# Altium schematic sheet MCU.SchDoc: =SheetTitle
size A3; CompanyName: Catcatcat Electronics; Engineer: Hena Chernov; SheetNumber: 6; SheetTotal: 10; CodePhone: +380505759863; SheetDescription: Microcontroller connection schematic.; Email: catcatcat.electronics@gmail.com
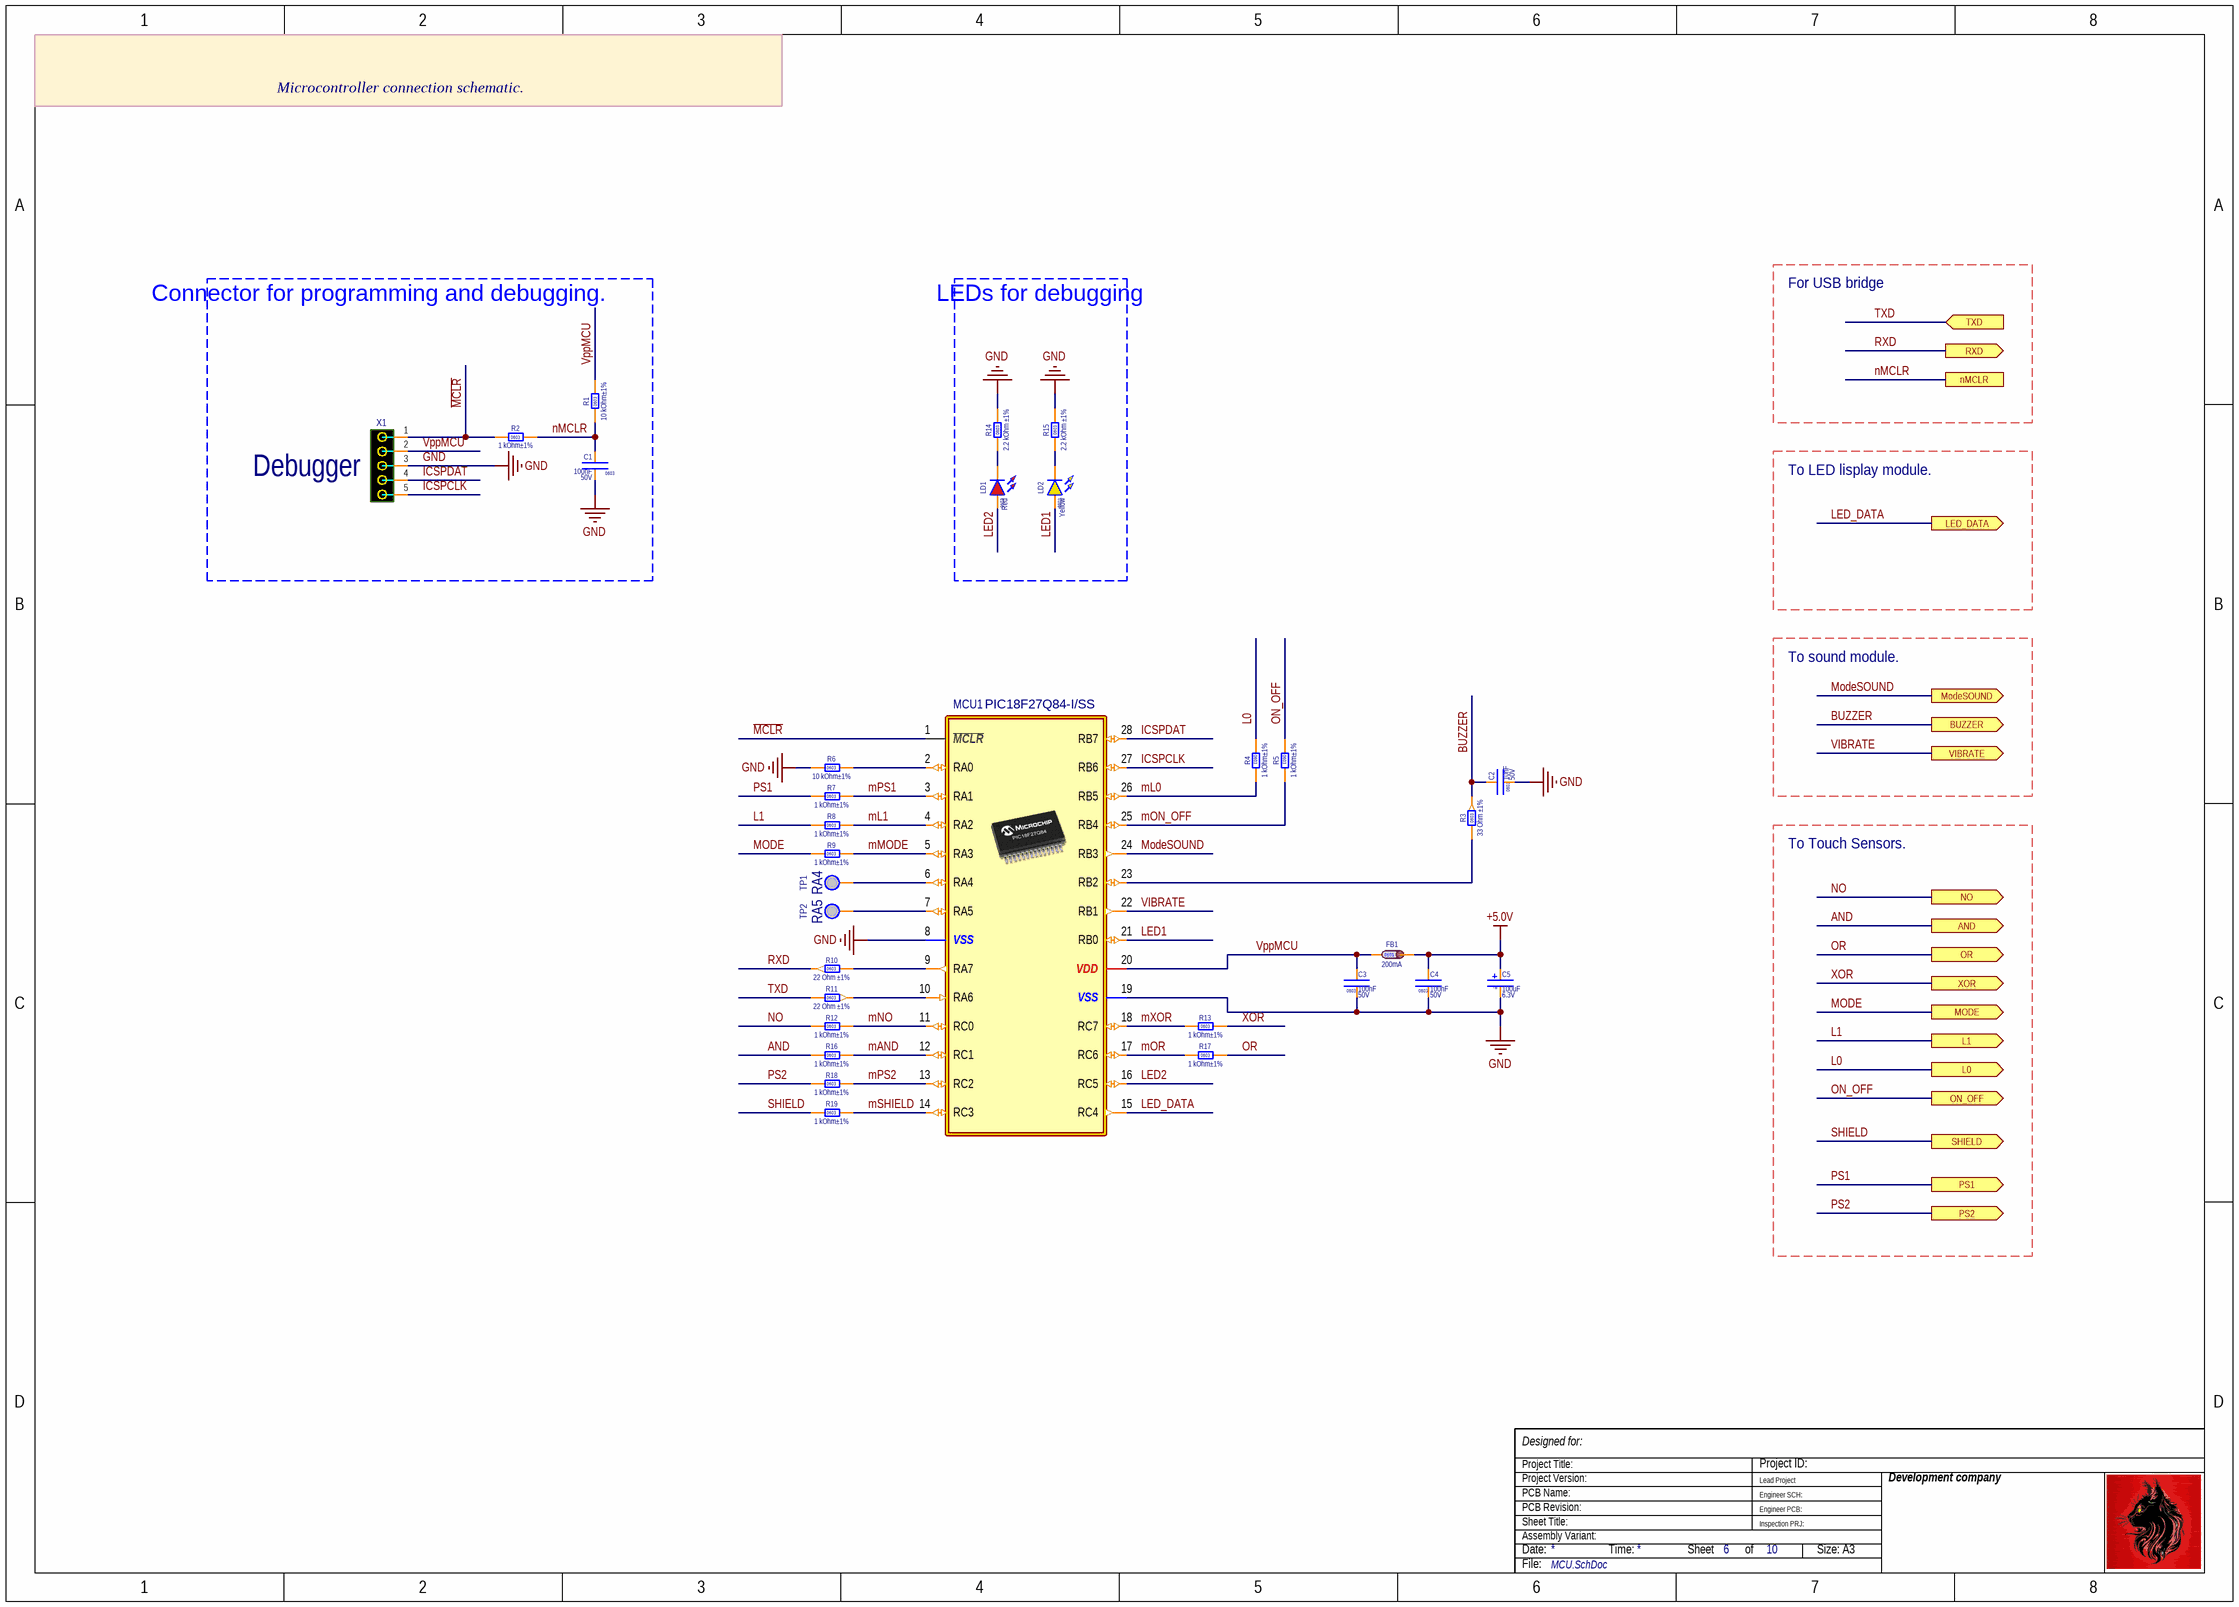
[diagram p0: MCU.SchDoc]

## Parts
C1  value 100nF  Voltage: 50V  [CC0603(1608)x0.8]  (hidden comment: 100 nF ±10% 50V)
C2  value 10nF  Voltage: 50V  [CC0603(1608)x0.8]  (hidden comment: 10 nF ±10% 50V)
C3  value 100nF  Voltage: 50V  [CC0603(1608)x0.8]  (hidden comment: 100 nF ±10% 50V)
C4  value 100nF  Voltage: 50V  [CC0603(1608)x0.8]  (hidden comment: 100 nF ±10% 50V)
C5  value 100uF  Voltage: 6.3V  [TANTAL_B]  (hidden comment: 100UF 6.3V CASE-B_3528)
FB1  value 200mA  [FB0603(1608)]  (hidden comment: GZ1608D601TF)
LD1  value Red  Case/Package: 0603  [LD0603 RED]  (hidden comment: KT-0603R)
LD2  value Yellow  Case/Package: 0603  [LD0603 YELLOW]  (hidden comment: LED 0603 Yellow 120° 60mW)
MCU1  PIC18F27Q84-I/SS  [FP-C04-073-IPC_C]
R1  value 10 kOhm±1%  [RC0603(1608) -1%]  (hidden comment: 10K ±1% 0603)
R2  value 1 kOhm±1%  [RC0603(1608) -1%]  (hidden comment: 1K ±1% 0603)
R3  value 33 Ohm ±1%  [RC0603(1608) -1%]  (hidden comment: 33R ±1% 0603)
R4  value 1 kOhm±1%  [RC0603(1608) -1%]  (hidden comment: 1K ±1% 0603)
R5  value 1 kOhm±1%  [RC0603(1608) -1%]  (hidden comment: 1K ±1% 0603)
R6  value 10 kOhm±1%  [RC0603(1608) -1%]  (hidden comment: 10K ±1% 0603)
R7  value 1 kOhm±1%  [RC0603(1608) -1%]  (hidden comment: 1K ±1% 0603)
R8  value 1 kOhm±1%  [RC0603(1608) -1%]  (hidden comment: 1K ±1% 0603)
R9  value 1 kOhm±1%  [RC0603(1608) -1%]  (hidden comment: 1K ±1% 0603)
R10  value 22 Ohm ±1%  [RC0603(1608) -1%]  (hidden comment: 22R ±1% 0603)
R11  value 22 Ohm ±1%  [RC0603(1608) -1%]  (hidden comment: 22R ±1% 0603)
R12  value 1 kOhm±1%  [RC0603(1608) -1%]  (hidden comment: 1K ±1% 0603)
R13  value 1 kOhm±1%  [RC0603(1608) -1%]  (hidden comment: 1K ±1% 0603)
R14  value 2.2 kOhm ±1%  [RC0603(1608) -1%]  (hidden comment: 2.2K ±1% 0603)
R15  value 2.2 kOhm ±1%  [RC0603(1608) -1%]  (hidden comment: 2.2K ±1% 0603)
R16  value 1 kOhm±1%  [RC0603(1608) -1%]  (hidden comment: 1K ±1% 0603)
R17  value 1 kOhm±1%  [RC0603(1608) -1%]  (hidden comment: 1K ±1% 0603)
R18  value 1 kOhm±1%  [RC0603(1608) -1%]  (hidden comment: 1K ±1% 0603)
R19  value 1 kOhm±1%  [RC0603(1608) -1%]  (hidden comment: 1K ±1% 0603)
TP1  RA4  [Test_Point_T_0.6mm]  (no BOM)
TP2  RA5  [Test_Point_T_0.6mm]  (no BOM)
X1  PL2N-05n  [PL2N-05]  (value not drawn)

## Blocks framed on the sheet
Debugger: C1 R1 R2 X1
LEDs for debugging: LD1 LD2 R14 R15

## Ports
AND (out), BUZZER (out), L0 (out), L1 (out), LED_DATA (out), MODE (out), ModeSOUND (out), nMCLR, NO (out), ON_OFF (out), OR (out), PS1 (out), PS2 (out), RXD (out), SHIELD (out), TXD (in), VIBRATE (out), XOR (out)

## Nets
+5.0V: C4.2 C5.1 FB1.1
GND: C1.1 C2.1 C3.1 C4.1 C5.2 MCU1.8(VSS) MCU1.19(VSS) R6.1 R14.1 R15.1 X1.3
~{MCLR}: MCU1.1(~{MCLR}) R2.2 X1.1
AND: R16.2 ; port AND
BUZZER: C2.2 R3.2 ; port BUZZER
ICSPCLK: MCU1.27(RB6) X1.5
ICSPDAT: MCU1.28(RB7) X1.4
L0: R4.1 ; port L0
L1: R8.1 ; port L1
LED1: LD2.2 MCU1.21(RB0)
LED2: LD1.2 MCU1.16(RC5)
LED_DATA: MCU1.15(RC4) ; port LED_DATA
mAND: MCU1.12(RC1) R16.1
mL0: MCU1.26(RB5) R4.2
mL1: MCU1.4(RA2) R8.2
mMODE: MCU1.5(RA3) R9.1
mNO: MCU1.11(RC0) R12.1
MODE: R9.2 ; port MODE
ModeSOUND: MCU1.24(RB3) ; port ModeSOUND
mON_OFF: MCU1.25(RB4) R5.2
mOR: MCU1.17(RC6) R17.1
mPS1: MCU1.3(RA1) R7.2
mPS2: MCU1.13(RC2) R18.1
mSHIELD: MCU1.14(RC3) R19.2
mXOR: MCU1.18(RC7) R13.1
nMCLR: C1.2 R1.1 R2.1 ; port nMCLR
NO: R12.2 ; port NO
ON_OFF: R5.1 ; port ON_OFF
OR: R17.2 ; port OR
PS1: R7.1 ; port PS1
PS2: R18.2 ; port PS2
RXD: R10.1 ; port RXD
SHIELD: R19.1 ; port SHIELD
TXD: R11.1 ; port TXD
VIBRATE: MCU1.22(RB1) ; port VIBRATE
VppMCU: C3.2 FB1.2 MCU1.20(VDD) R1.2 X1.2
XOR: R13.2 ; port XOR
NetLD1_1: LD1.1 R14.2
NetLD2_1: LD2.1 R15.2
NetMCU1_2: MCU1.2(RA0) R6.2
NetMCU1_6: MCU1.6(RA4) TP1.1
NetMCU1_7: MCU1.7(RA5) TP2.1
NetMCU1_9: MCU1.9(RA7) R10.2
NetMCU1_10: MCU1.10(RA6) R11.2
NetMCU1_23: MCU1.23(RB2) R3.1

## Notes on the sheet
- Connector for programming and debugging.
- For USB bridge
- To LED lisplay module.
- To sound module.
- To Touch Sensors.
- Project Title:
- Project Version:
- Designed for:
- Lead Project
- Project ID:
- Development company
- Date:
- PCB Revision:
- PCB Name:
- Sheet Title:
- Assembly Variant:
- Time:
- Sheet
- of
- Engineer SCH:
- Engineer PCB:
- Inspection PRJ:
- Size: A3
- File:
- (in symbol TANTAL-B 100uF 6.3V (B)) TB

## Library data of the parts
C1 C3 C4 = 0603 0.1 uF (B): 100 nF ±10% 50V X7R; Manufacturer 1: YAGEO; Manufacturer Part Number 1: CC0603KRX7R9BB104; Note: Ceramic Capacitors; Detailed Description: 50V 100nF X7R ±10% 0603  Multilayer Ceramic Capacitors MLCC - SMD/SMT ROHS; Case/Package: 0603; Publisher: Catcatcat Electronics; Tolerance: ±10%; HelpURL: https://datasheet.lcsc.com/lcsc/1809301912_YAGEO-CC0603KRX7R9BB104_C14663.pdf; website developer: http://catcatcat.d-lan.dp.ua/; Temperature Coefficient: X7R; Supplier URL 1: https://jlcpcb.com/parts/componentSearch?searchTxt=; Operating Temperature: -55C to +125C; Supplier Part Number 1: C14663; Supplier Unit Price 1: 0.0021; Assembly type: Basic Part; Footprint check status: Verified; QuantityElements: 1; Supplier 1: LCSC; MountType: SMD
C2 = 0603 0.01 uF (B): 10 nF ±10% 50V X7R; Manufacturer 1: Guangdong Fenghua Advanced Tech; Manufacturer Part Number 1: 0603B103K500NT; Note: Ceramic Capacitors; Detailed Description: 50V 10nF X7R ±10% 0603  Multilayer Ceramic Capacitors MLCC - SMD/SMT ROHS; Case/Package: 0603; Publisher: Catcatcat Electronics; Tolerance: ±10%; HelpURL: https://datasheet.lcsc.com/szlcsc/Guangdong-Fenghua-Advanced-Tech-0603B103K500NT_C57112.pdf; Website Developer: http://catcatcat.d-lan.dp.ua/; Temperature Coefficient: X7R; Supplier URL 1: https://jlcpcb.com/parts/componentSearch?searchTxt=; Operating Temperature: -55C to +125C; Supplier Part Number 1: C57112; Supplier Unit Price 1: 0.0012; Assembly type: Basic Part; Footprint check status: Verified; QuantityElements: 1; Supplier 1: LCSC; MountType: SMD
C5 = TANTAL-B 100uF 6.3V (B): Tantalum Capacitors 100uF 6.3V CASE-B_3528 RoHS; Manufacturer 1: AVX; Manufacturer Part Number 1: TAJB107K006RNJ; Lifetime @ Temp: 2000Hrs@105℃; Case/Package: CASE-B_3528; Publisher: Catcatcat Electronics; Note: Tantalum Capacitors; HelpURL: https://datasheet.lcsc.com/szlcsc/AVX-TAJB107K006RNJ_C16133.pdf; website developer: http://catcatcat.d-lan.dp.ua/; Detailed Description: Tantalum Capacitors 100uF 6.3V CASE-B_3528 RoHS; Supplier URL 1: https://jlcpcb.com/parts/componentSearch?searchTxt=; Supplier Part Number 1: C16133; Supplier Unit Price 1: 0.1177; Assembly type: Basic Part; Footprint check status: Verified; QuantityElements: 1; Supplier 1: LCSC; MountType: SMD
FB1 = 0603 GZ1608D601TF (B): 0.20A 600 Ohm @100MHz 450 mOhm; Manufacturer 1: Sunlord; Temp.Characteristic: -55°C ~ 125°C; Note: Ferrite Beads and Chips; Detailed Description: 450mΩ ±25% 600Ω@100MHz 0603  Ferrite Beads ROHS; Case/Package: 0603; Publisher: Catcatcat Electronics; HelpURL: https://datasheet.lcsc.com/lcsc/1811091241_Sunlord-GZ1608D601TF_C1002.pdf; website developer: http://catcatcat.d-lan.dp.ua/; Manufacturer Part Number 1: GZ1608D601TF; Supplier URL 1: https://jlcpcb.com/parts/componentSearch?searchTxt=; Supplier Part Number 1: C1002; Supplier Unit Price 1: 0.0045; Assembly type: Basic Part; Footprint check status: Verified; QuantityElements: 1; Supplier 1: LCSC; MountType: SMD
LD1 = KT-0603R (B): 0603 Red 520~625NM 90~100MCD@20MA Top View RoHS; Manufacturer 1: Hubei KENTO Elec; Note: LED Red; Temp.Characteristic: -40C to +85C; Detailed Description: -40℃~+85℃ Red 0603  Light Emitting Diodes (LED) ROHS; Millicandela Rating: 30~50mcd@5mA; Wavelength(Range or typical): 619~625nm; Publisher: Catcatcat Electronics; Manufacturer Part Number 1: KT-0603R; Supplier URL 1: https://www.lcsc.com/product-detail/Light-Emitting-Diodes-LED_Hubei-KENTO-Elec-KT-0603R_C2286.html; Operating Temperature: -40°C~+85°C; Supplier Part Number 1: C2286; Supplier Unit Price 1: 0.0053; HelpURL: https://datasheet.lcsc.com/szlcsc/Hubei-KENTO-Elec-KT-0603R_C2286.pdf; Website developer: http://catcatcat.d-lan.dp.ua/; Assembly type: Basic Part; Footprint check status: Verified; QuantityElements: 1; Supplier 1: LCSC; MountType: SMD
LD2 = 19-213/Y2C-CQ2R2L/3T(CY) (B): 0603 Yellow Colorless transparence -40℃~+85℃ 585.5nm~591.5nm yellow 120° 60mW 0603  Light Emitting Diodes (LED) ROHS; Manufacturer 1: Everlight Elec; Temp.Characteristic: -40C to +85C; Millicandela Rating: 90~180mcd@20mA; Wavelength(Range or typical): 585.5~591.5nm; Publisher: Catcatcat Electronics; Note: Light Emitting Diodes; Manufacturer Part Number 1: 19-213/Y2C-CQ2R2L/3T(CY); Detailed Description: Colorless transparence -40℃~+85℃ 585.5nm~591.5nm yellow 120° 60mW 0603  Light Emitting Diodes (LED) ROHS; Supplier URL 1: https://www.lcsc.com/product-detail/Light-Emitting-Diodes-LED_Everlight-Elec-19-213-Y2C-CQ2R2L-3T-CY_C72038.html; Supplier Part Number 1: C72038; Supplier Unit Price 1: 0.0195; HelpURL: https://datasheet.lcsc.com/lcsc/1810101813_Everlight-Elec-19-213-Y2C-CQ2R2L-3T-CY_C72038.pdf; Website developer: http://catcatcat.d-lan.dp.ua/; Assembly type: Basic Part; Footprint check status: Verified; QuantityElements: 1; Supplier 1: LCSC; MountType: SMD
MCU1 = PIC18F27Q84-I/SS (E): SSOP-28, 128KB 1.8V~5.5V PIC 64MHz 25 SSOP-28-208mil Microcontroller Units (MCUs/MPUs/SOCs) ROHS; Manufacturer 1: Microchip Tech; Temp.Characteristic: -40C to +85C; Supplier Unit Price 1: 3.1065; Note: Microcontroller; Voltage: 1.8V~5.5V; HelpURL: https://ww1.microchip.com/downloads/aemDocuments/documents/MCU08/ProductDocuments/DataSheets/PIC18F27-47-57Q84-Data-Sheet-40002213D.pdf; Manufacturer Part Number 1: PIC18F27Q84-I/SS; Website Developer: http://catcatcat.d-lan.dp.ua/; Detailed Description: SSOP-28-208mil  Microcontroller Units (MCUs/MPUs/SOCs) ROHS; Speed: 64MHz; Case/Package: SSOP-28-208mil; Supplier URL 1: https://www.lcsc.com/product-detail/Microcontroller-Units-MCUs-MPUs-SOCs_Microchip-Tech-PIC18F27Q84-I-SS_C2987163.html; Manufacturer URL: https://www.microchip.com/en-us/product/PIC18F27Q84; Operating Temperature: -40℃~+85℃; Supplier Part Number 1: C2987163; Publisher: Catcatcat Electronics; Assembly type: Extended Part; Footprint check status: Verified; QuantityElements: 1; Supplier 1: LCSC; MountType: SMD; ECCN: EAR99; Value: PIC18F27Q84-I/SS
R1 R6 = 0603 10 kOhm ±1% (B): 10 k (103) ±1% 1/10W; Manufacturer 1: Uniroyal Elec; Manufacturer Part Number 1: 0603WAF1002T5E; Voltage: 50V; Note: Chip Resistor - Surface Mount; Marking: 103; Temperature Coefficient: ±100ppm/°C; Detailed Description: CHIP RESISTOR - SURFACE MOUNT 10KOHMS ±1% 1/10W 0603 ROHS; Publisher: Catcatcat Electronics; Tolerance: ±1%; HelpURL: https://datasheet.lcsc.com/szlcsc/Uniroyal-Elec-0603WAF1002T5E_C25804.pdf; Website Developer: http://catcatcat.d-lan.dp.ua/; Power (Watts): 1/10W; Supplier URL 1: https://jlcpcb.com/parts/componentSearch?searchTxt=C25804; Operating Temperature: -55°C ~ 155°C; Supplier Part Number 1: C25804; Supplier Unit Price 1: 0.0008; Assembly type: Basic Part; Footprint check status: Verified; QuantityElements: 1; Supplier 1: LCSC; MountType: SMD; Case/Package: 0603
R2 R4 R5 R7-R9 R12 R13 R16-R19 = 0603 1 kOhm ±1% (B): 1 k (01B) ±1% 1/10W; Manufacturer 1: Uniroyal Elec; Manufacturer Part Number 1: 0603WAF1001T5E; Voltage: 75V; Note: Chip Resistor - Surface Mount; Marking: 102; Temperature Coefficient: ±100ppm/°C; Detailed Description: 100mW Thick Film Resistors ±100ppm/℃ ±1% 1kΩ 0603  Chip Resistor - Surface Mount ROHS; Publisher: Catcatcat Electronics; Tolerance: ±1%; HelpURL: https://datasheet.lcsc.com/szlcsc/Uniroyal-Elec-0603WAF1001T5E_C21190.pdf; Website Developer: http://catcatcat.d-lan.dp.ua/; Power (Watts): 1/10W; Supplier URL 1: https://jlcpcb.com/parts/componentSearch?searchTxt=; Operating Temperature: -55°C ~ 155°C; Supplier Part Number 1: C21190; Supplier Unit Price 1: 0.0005; Assembly type: Basic Part; Footprint check status: Verified; QuantityElements: 1; Supplier 1: LCSC; MountType: SMD; Case/Package: 0603
R3 = 0603 33 Ohm ±1% (B): 33 R (330) ±1% 1/10W 50V; Manufacturer 1: Uniroyal Elec; Manufacturer Part Number 1: 0603WAF330JT5E; Note: Chip Resistor - Surface Mount; Temperature Coefficient: ±100ppm/°C; Detailed Description: CHIP RESISTOR - SURFACE MOUNT 33OHMS ±1% 1/10W 0603 ROHS; Publisher: Catcatcat Electronics; Tolerance: ±1%; Voltage: 50V; HelpURL: https://datasheet.lcsc.com/szlcsc/Uniroyal-Elec-0603WAF330JT5E_C23140.pdf; Website Developer: http://catcatcat.d-lan.dp.ua/; Power (Watts): 1/10W; Supplier URL 1: https://jlcpcb.com/parts/componentSearch?searchTxt=; Operating Temperature: -55°C ~ 155°C; Supplier Part Number 1: C23140; Supplier Unit Price 1: 0.0014; Assembly type: Basic Part; Footprint check status: Verified; QuantityElements: 1; Supplier 1: LCSC; MountType: SMD; Case/Package: 0603
R10 R11 = 0603 22 Ohm ±1% (B): 22 R (220) ±1% 1/10W 50V; Manufacturer 1: Uniroyal Elec; Manufacturer Part Number 1: 0603WAF220JT5E; Note: Chip Resistor - Surface Mount; Temperature Coefficient: ±100ppm/°C; Detailed Description: 100mW Thick Film Resistors ±100ppm/℃ ±1% 22Ω 0603  Chip Resistor - Surface Mount ROHS; Publisher: Catcatcat Electronics; Tolerance: ±1%; Voltage: 50V; HelpURL: Uniroyal-Elec-0603WAF220JT5E_C23345.pdf; Website Developer: http://catcatcat.d-lan.dp.ua/; Power (Watts): 1/10W; Supplier URL 1: https://jlcpcb.com/parts/componentSearch?searchTxt=; Operating Temperature: -55°C ~ 155°C; Supplier Part Number 1: C23345; Supplier Unit Price 1: 0.0009; Assembly type: Basic Part; Footprint check status: Verified; QuantityElements: 1; Supplier 1: LCSC; MountType: SMD; Case/Package: 0603
R14 R15 = 0603 2.2 kOhm ±1% (B): 2.2 k (222) ±1% 1/10W 50V; Manufacturer 1: Uniroyal Elec; Manufacturer Part Number 1: 0603WAF2201T5E; Note: Chip Resistor - Surface Mount; Marking: 222; Temperature Coefficient: ±100ppm/℃; Detailed Description: 100mW Thick Film Resistors ±100ppm/℃ ±1% 2.2kΩ 0603  Chip Resistor - Surface Mount ROHS; Publisher: Catcatcat Electronics; Tolerance: ±1%; Voltage: 50V; HelpURL: https://datasheet.lcsc.com/szlcsc/Uniroyal-Elec-0603WAF2201T5E_C4190.pdf; Website Developer: http://catcatcat.d-lan.dp.ua/; Power (Watts): 1/10W; Supplier URL 1: https://jlcpcb.com/parts/componentSearch?searchTxt=; Operating Temperature: -55°C ~ 155°C; Supplier Part Number 1: C4190; Supplier Unit Price 1: 0.0009; Assembly type: Basic Part; Footprint check status: Verified; QuantityElements: 1; Supplier 1: LCSC; MountType: SMD; Case/Package: 0603
TP1 TP2 = Test_Point smd_0.6: Test Point TOP; Value: SMD; Assembly type: Test Point; Note: Test Point; Publisher: Catcatcat Electronics; Website developer: http://catcatcat.d-lan.dp.ua/; Footprint check status: Verified; Supplier URL 1: https://jlcpcb.com/parts/componentSearch?searchTxt=; Supplier 1: LCSC
X1 = PL2N-05n: 2.0 mm; Value: 5*2mm; Note: Connector; Temp.Characteristic: -40C to +85C; Supplier URL 1: https://jlcpcb.com/parts/componentSearch?searchTxt=; Publisher: Catcatcat Electronics; Manufacturer 1: http://www.jinlingdz.com; Website Developer: http://catcatcat.d-lan.dp.ua/; Assembly type: Manual Part; Footprint check status: Verified; QuantityElements: 1; Operating Temperature: -40℃~+105℃; MountType: TH